# EAGLE design Motor Controller V.5.2 (EAGLE 9.6.2)
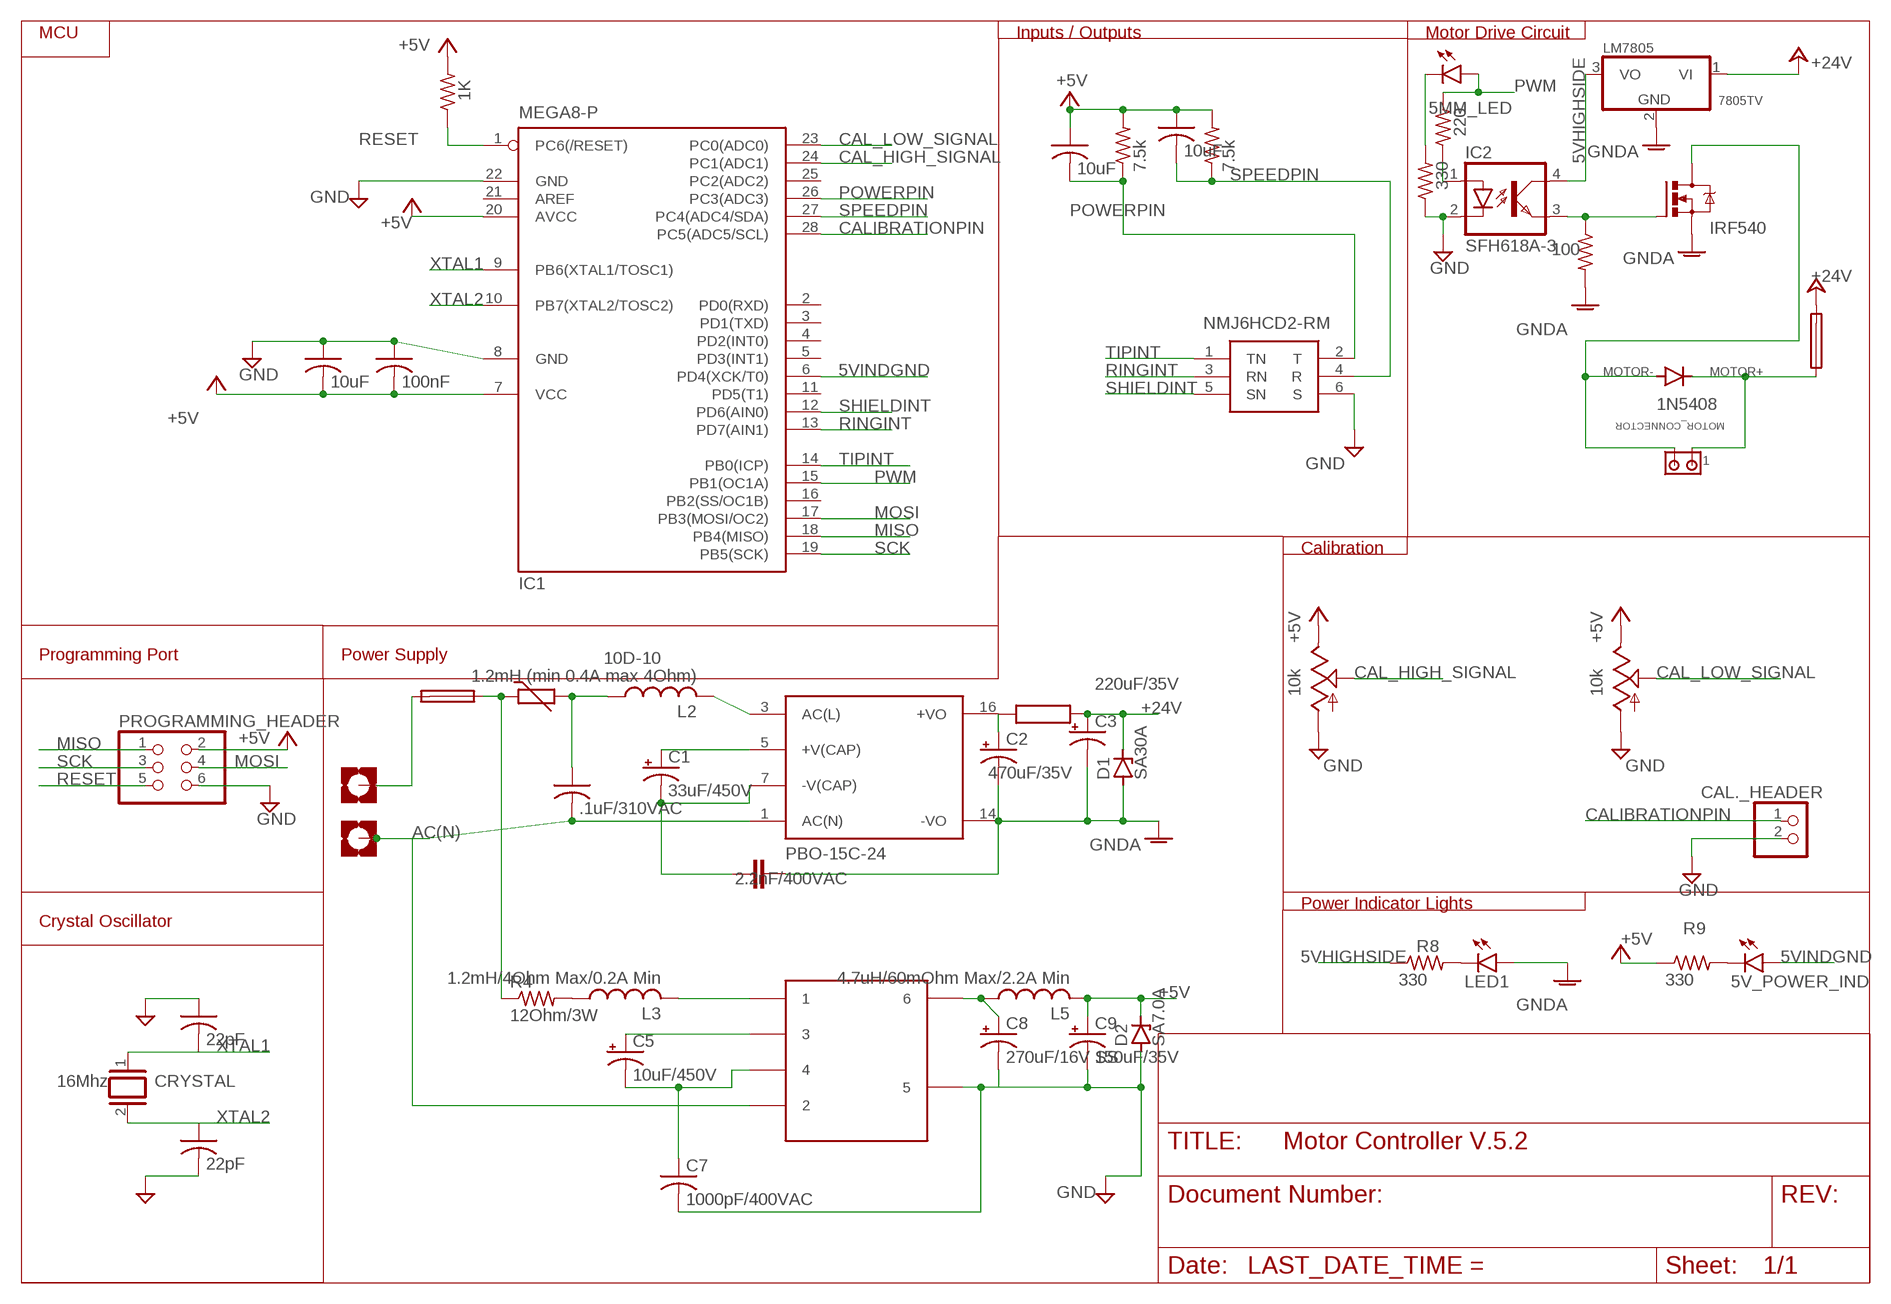
[diagram p0: schematic, sheet 1]

## Parts
5V_POWER_IND  LED3MM  [LED3MM]
AC(N)  PAD3.0  [3,0-PAD-SQUARE]
C1  33uF/450V  CPOL-USE5-13  [E5-13]
C2  470uF/35V  CPOL-USE5-10.5  [E5-10,5]
C3  220uF/35V  CPOL-USE5-10.5  [E5-10,5]
C4  .1uF/310VAC  CMPP_AC275V104K10S6  [C102-064X133]
C5  10uF/450V  CPOL-USE5-10.5  [E5-10,5]
C6  22pF  C-US025-024X044  [C025-024X044]
C7  1000pF/400VAC  C-US075-052X106  [C075-052X106]
C8  270uF/16V SS  CPOL-USE2.5-6  [E2,5-6]
C9  150uF/35V  CPOL-USE3.5-8  [E3,5-8]
C10  10uF  C-US025-024X044  [C025-024X044]
C12  10uF  C-US025-024X044  [C025-024X044]
C13  10uF  C-US025-024X044  [C025-024X044]
C14  100nF  C-US025-024X044  [C025-024X044]
C15  22pF  C-US025-024X044  [C025-024X044]
CAL._HEADER  PINHD-1X2  [1X02]
CRYSTAL  16Mhz  XTAL/S  [QS]
CY1  2.2nF/400VAC  CYYC10B4  [YC10B4]
D1  SA30A  TVSDIO  [TVS-10]
D2  SA7.0A  TVSDIO  [TVS-10]
D3  1N5408  1N5400  [DO201-15]
F1  FUSESH22,5  [SH22,5]
F2  1A/300V  FUSESH22,5  [SH22,5]
FAST  10k  TRIM_US-CT6  [CT6]
H1  PAD3.0  [3,0-PAD-SQUARE]
IC1  MEGA8-P  [DIL28-3]
IC2  SFH618A-3  [DIP4]
J1  NMJ6HCD2-RM  [NMJ6HCD2RM]
L2  1.2mH (min 0.4A max 4Ohm)  RCP_1317_INDUCTOR  [RCP1317_INDUCTOR]
L3  1.2mH/4Ohm Max/0.2A Min  RCP_1317_INDUCTOR  [RCP1317_INDUCTOR]
L5  4.7uH/60mOhm Max/2.2A Min  RLB0914_INDUCTOR  [RLB0914_INDUCTOR]
LED1  LED3MM  [LED3MM]
LM7805  7805TV  [TO220V]
MOTOR_CONNECTOR  MATE-N-LOK_193839-1  [MATE-N-LOK_2PIN_CONNECTOR]
PROGRAMMING_HEADER  PINHD-2X3  [2X03]
PS1  PBO-15C-24  [CONV_PBO-15C-24]
PWM_IND  5MM_LED  [5MM_LED]
Q1  IRF540  [TO220BV]
R1  10D-10  THERMISTOR-7,5  [R-7,5]
R2  1K  R-US_0204/7  [0204/7]
R3  7.5k  R-US_0204/7  [0204/7]
R4  12Ohm/3W  BIGRESISTOR  [VTA52]
R5  220  R-US_0204/7  [0204/7]
R6  100  R-US_0204/7  [0204/7]
R7  7.5k  R-US_0204/7  [0204/7]
R8  330  R-US_0204/7  [0204/7]
R9  330  R-US_0204/7  [0204/7]
R10  330  R-US_0204/7  [0204/7]
SLOW  10k  TRIM_US-CT6  [CT6]
U$1  L503-13B05R  [LS03-13BO5R3]
U$2  HCTI-22-16.4  [HCTI-22-16.4]

## Nets
5VHIGHSIDE: IC2.4(COL) LM7805.3(VO) R8.1
5VINDGND: 5V_POWER_IND.A IC1.6(PD4(XCK/T0))
+5V: C9.+ C10.1 C12.1 C13.2 C14.2 D2.C FAST.E IC1.7(VCC) IC1.20(AVCC) L5.P$2 PROGRAMMING_HEADER.2 R2.2 R3.2 R7.2 R9.1 SLOW.E
+24V: C3.+ D1.C F1.2 LM7805.1(VI) U$2.P$2
AC(L): L2.P$2 PS1.3(AC(L))
AC(N): AC(N).B3,0(MOUNT) C4.2 PS1.1(AC(N)) U$1.3 U$1.4
CAL_HIGH_SIGNAL: FAST.S IC1.24(PC1(ADC1))
CAL_LOW_SIGNAL: IC1.23(PC0(ADC0)) SLOW.S
CALIBRATIONPIN: CAL._HEADER.1 IC1.28(PC5(ADC5/SCL))
GND: C6.2 C7.2 C8.- C9.- C13.1 C14.1 C15.1 CAL._HEADER.2 D2.A FAST.A IC1.8(GND) IC1.22(GND) IC2.2(C) J1.6(S) PROGRAMMING_HEADER.6 R10.1 SLOW.A U$1.9 U$1.10
GNDA: C2.- C3.- CY1.1 D1.A LED1.A LM7805.2(GND) PS1.14(-VO) Q1.S R6.2
MISO: IC1.18(PB4(MISO)) PROGRAMMING_HEADER.1
MOSI: IC1.17(PB3(MOSI/OC2)) PROGRAMMING_HEADER.4
MOTOR+: D3.C F1.1 MOTOR_CONNECTOR.P$1
MOTOR-: D3.A MOTOR_CONNECTOR.P$2 Q1.D
N$1: IC2.1(A) R5.1
N$2: IC2.3(EMIT) Q1.G R6.1
N$3: LED1.K(C) R8.2
N$4: C2.+ PS1.16(+VO) U$2.P$1
N$5: C1.+ PS1.5(+V(CAP))
N$6: C1.- CY1.2 PS1.7(-V(CAP))
N$8: F2.2 H1.B3,0(MOUNT)
N$9: F2.1 R1.1 R4.1
N$10: C4.1 L2.P$1 R1.2
N$12: 5V_POWER_IND.K(C) R9.2
N$13: L3.P$1 R4.2
N$14: L3.P$2 U$1.1 U$1.2
N$15: C5.+ U$1.5 U$1.6
N$16: C5.- C7.1 U$1.7 U$1.8
N$17: C8.+ L5.P$1 U$1.11 U$1.12
N$19: PWM_IND.C R10.2
POWERPIN: C10.2 IC1.26(PC3(ADC3)) J1.2(T) R3.1
PWM: IC1.15(PB1(OC1A)) PWM_IND.A R5.2
RESET: IC1.1(PC6(/RESET)) PROGRAMMING_HEADER.5 R2.1
RINGINT: IC1.13(PD7(AIN1)) J1.3(RN)
SCK: IC1.19(PB5(SCK)) PROGRAMMING_HEADER.3
SHIELDINT: IC1.12(PD6(AIN0)) J1.5(SN)
SPEEDPIN: C12.2 IC1.27(PC4(ADC4/SDA)) J1.4(R) R7.1
TIPINT: IC1.14(PB0(ICP)) J1.1(TN)
XTAL1: C15.2 CRYSTAL.1 IC1.9(PB6(XTAL1/TOSC1))
XTAL2: C6.1 CRYSTAL.2 IC1.10(PB7(XTAL2/TOSC2))
Unconnected: IC1.2(PD0(RXD)) IC1.3(PD1(TXD)) IC1.4(PD2(INT0)) IC1.5(PD3(INT1)) IC1.11(PD5(T1)) IC1.16(PB2(SS/OC1B)) IC1.21(AREF) IC1.25(PC2(ADC2))

## Notes on the sheet
- MCU | Inputs / Outputs | Motor Drive Circuit
- Calibration
- Programming Port | Power Supply
- Power Indicator Lights
- Crystal Oscillator

## Library data of the parts
5V_POWER_IND LED1 = led:LED: LED OSRAM: - CHIPLED LG R971, LG N971, LY N971, LG Q971, LY Q971, LO R971, LY R971 LH N974, LH R974 LS Q976, LO Q976, LY Q976 LO Q996 - Hyper CHIPLED LW Q18S LB Q993, LB Q99A, LB R99A - SideLED LS A670, LO A670, LY A670, LG A670, LP A670 LB A673, LV A673, LT A673, LW A673 LH A674 LY A675 LS A676, LA A676, LO A676, LY A676, LW A676 LS A679, LY A679, LG A679 - Hyper Micro SIDELED® LS Y876, LA Y876, LO Y876, LY Y876 LT Y87S - SmartLED LW L88C, LW L88S LB L89C, LB L89S, LG L890 LS L89K, LO L89K, LY L89K LS L896, LA L896, LO L896, LY L896 - TOPLED LS T670, LO T670, LY T670, LG T670, LP T670 LSG T670, LSP T670, LSY T670, LOP T670, LYG T670 LG T671, LOG T671, LSG T671 LB T673, LV T673, LT T673, LW T673 LH T674 LS T676, LA T676, LO T676, LY T676, LB T676, LH T676, LSB T676, LW T676 LB T67C, LV T67C, LT T67C, LS T67K, LO T67K, LY T67K, LW E67C LS E67B, LA E67B, LO E67B, LY E67B, LB E67C, LV E67C, LT E67C LW T67C LS T679, LY T679, LG T679 LS T770, LO T770, LY T770, LG T770, LP T770 LB T773, LV T773, LT T773, LW T773 LH T774 LS E675, LA E675, LY E675, LS T675 LS T776, LA T776, LO T776, LY T776, LB T776 LHGB T686 LT T68C, LB T68C - Hyper Mini TOPLED® LB M676 - Mini TOPLED Santana® LG M470 LS M47K, LO M47K, LY M47K Source: http://www.osram.convergy.de LUXEON: - LUMILED® LXK2-PW12-R00, LXK2-PW12-S00, LXK2-PW14-U00, LXK2-PW14-V00 LXK2-PM12-R00, LXK2-PM12-S00, LXK2-PM14-U00 LXK2-PE12-Q00, LXK2-PE12-R00, LXK2-PE12-S00, LXK2-PE14-T00, LXK2-PE14-U00 LXK2-PB12-K00, LXK2-PB12-L00, LXK2-PB12-M00, LXK2-PB14-N00, LXK2-PB14-P00, LXK2-PB14-Q00 LXK2-PR12-L00, LXK2-PR12-M00, LXK2-PR14-Q00, LXK2-PR14-R00 LXK2-PD12-Q00, LXK2-PD12-R00, LXK2-PD12-S00 LXK2-PH12-R00, LXK2-PH12-S00 LXK2-PL12-P00, LXK2-PL12-Q00, LXK2-PL12-R00 Source: www.luxeon.com KINGBRIGHT: KA-3528ASYC Source: www.kingbright.com
AC(N) H1 = Benson Motor Controller:PAD3.0; OC_NEWARK: unknown
C1 C5 C8 C9 = rcl:CPOL-US: POLARIZED CAPACITOR, American symbol; OC_NEWARK: unknown; SPICEPREFIX: C
C2 = rcl:CPOL-US: POLARIZED CAPACITOR, American symbol; MF: PANASONIC; MPN: ECA1VHG471B; OC_NEWARK: 65AH6137; SPICEPREFIX: C
C3 = rcl:CPOL-US: POLARIZED CAPACITOR, American symbol; MF: KEMET; MPN: A768KS227M1VLAE024; OC_NEWARK: 92AH3968; SPICEPREFIX: C
C4 = Benson Motor Controller:CMPP_AC275V104K10S6: capacitor .1uf 275VAC; OC_NEWARK: unknown
C6 C7 C10 C12-C15 = rcl:C-US: CAPACITOR, American symbol; OC_NEWARK: unknown; SPICEPREFIX: C
CAL._HEADER = pinhead:PINHD-1X2: PIN HEADER; OC_NEWARK: unknown
CRYSTAL = special:XTAL/S: CRYSTAL; OC_NEWARK: unknown
CY1 = rcl:CY: Y CAPACITOR for power line; OC_NEWARK: unknown; SPICEPREFIX: C
D1 D2 = Benson Motor Controller:TVSDIO: TVS diode 9.0mm hole spacing; OC_NEWARK: unknown
D3 = diode:1N5400: DIODE standard rectifier, 3 A, 50 V (Motorola); MF: VISHAY; MPN: 1N5408-E3/54; OC_NEWARK: 05R6001
F1 F2 = fuse:FUSE: Fuse; OC_FARNELL: unknown; OC_NEWARK: unknown
FAST SLOW = pot:TRIM_US-: POTENTIOMETER; OC_NEWARK: unknown
IC1 = atmel:MEGA8-P: MICROCONTROLLER 8 Kbytes FLASH, 1 kbytes SRAM, 512 bytes EEPROM, USART, 4-channel 10 bit ADC, 2-channel 8 bit ADC Pin compatible with Atmega48, ATMega88, ATMega168 Source: avr.lbr; OC_FARNELL: unknown; OC_NEWARK: unknown
IC2 = optocoupler:SFH618?*: Optocoupler, Phototransistor Output, Low Input Current Source: Data sheet <http://www.vishay.com/docs/83673/sfh618.pdf>; MF: VISHAY/TELEFUNKEN; MPN: SFH618A-3; OC_FARNELL: 1020374; OC_NEWARK: 58K2209
J1 = SamacSys_Parts:NMJ6HCD2-RM: NMJ6HCD2-RM Phone Connectors 1/4" STERO JCK SWTCH FULL TRD NSE PC HORZ Source: Datasheet <https://www.mouser.com/datasheet/2/289/st-nmj6hcd2-1842677.pdf>; DESCRIPTION: NMJ6HCD2-RM Phone Connectors 1/4" STERO JCK SWTCH FULL TRD NSE PC HORZ; HEIGHT: 15.67mm; MANUFACTURER_NAME: Neutrik; MANUFACTURER_PART_NUMBER: NMJ6HCD2-RM; MOUSER_PART_NUMBER: 568-NMJ6HCD2-RM; MOUSER_PRICE-STOCK: https://www.mouser.co.uk/ProductDetail/Neutrik/NMJ6HCD2-RM?qs=%252B86TLfaev28zLpqKj2fOGg%3D%3D; OC_NEWARK: unknown
L2 L3 = Benson Motor Controller:RCP_1317_INDUCTOR; OC_NEWARK: unknown
L5 = Benson Motor Controller:RLB0914_INDUCTOR; OC_NEWARK: unknown
LM7805 = linear:78*: Positive VOLTAGE REGULATOR Source: http://cache.national.com/ds/LM/LM78L05.pdf http://www.fairchildsemi.com/ds/LM/LM7805.pdf; OC_NEWARK: unknown
MOTOR_CONNECTOR = Benson Motor Controller:MATE-N-LOK_193839-1: right angle connector mate n lok 193839-1 mates with pn 770017-1; OC_NEWARK: unknown
PROGRAMMING_HEADER = pinhead:PINHD-2X3: PIN HEADER; OC_NEWARK: unknown
PS1 = Benson Motor Controller:PBO-15C-24: Check prices <https://pricing.snapeda.com/parts/PBO-15C-24/CUI%20Inc./view-part?ref=eda>; AVAILABILITY: Warning; CUI_PURCHASE_URL: https://www.cui.com/product/internal-ac-dc-power-supplies/board-mount/pbo-15c-series?utm_source=snapeda.com&utm_medium=referral&utm_campaign=snapedaBOM; DESCRIPTION: 15 W, 85 ~ 305 Vac Input, Single Output, Open Frame, Board Mount, Ac-Dc Power Supply; MF: CUI Inc.; MP: PBO-15C-24; OC_NEWARK: unknown; PACKAGE: None; PRICE: None; PURCHASE-URL: https://pricing.snapeda.com/search/part/PBO-15C-24/?ref=eda
PWM_IND = Benson Motor Controller:5MM_LED
Q1 = transistor-power:IRF540: HEXFET Power MOSFET; OC_NEWARK: unknown
R1 = Benson Motor Controller:THERMISTOR: THERMISTOR Inrush current limiting resitor 10ohm 20% 2A 11mm datasheet <https://www.cantherm.com/wp-content/uploads/2018/08/MF72_AUG_2018.pdf>; OC_NEWARK: unknown
R2 R3 R5-R7 R10 = rcl:R-US_: RESISTOR, American symbol; OC_NEWARK: unknown; SPICEPREFIX: R
R4 = Benson Motor Controller:BIGRESISTOR; OC_NEWARK: unknown
R8 R9 = rcl:R-US_: RESISTOR, American symbol; SPICEPREFIX: R
U$1 = Benson Motor Controller:L503-13B05R: Mornsun 5V 3W Isolated Power supply LS03-13B05R Datasheet <https://www.mornsun-power.com/html/pdf/LS03-13BxxR3.html>; OC_NEWARK: unknown
U$2 = Benson Motor Controller:HCTI-22-16.4

## Board
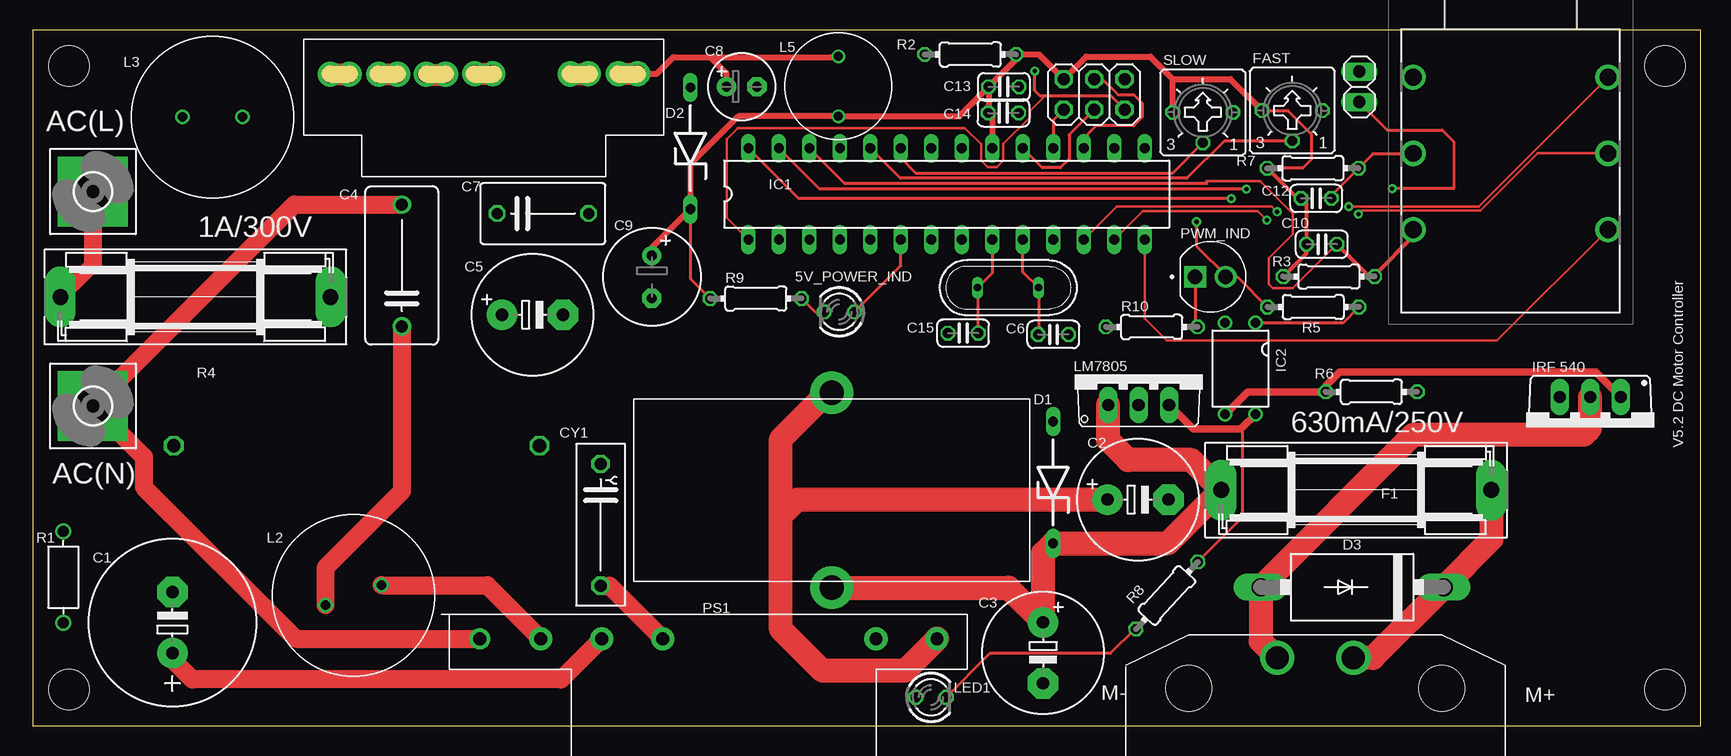
[diagram p1: board, top side]
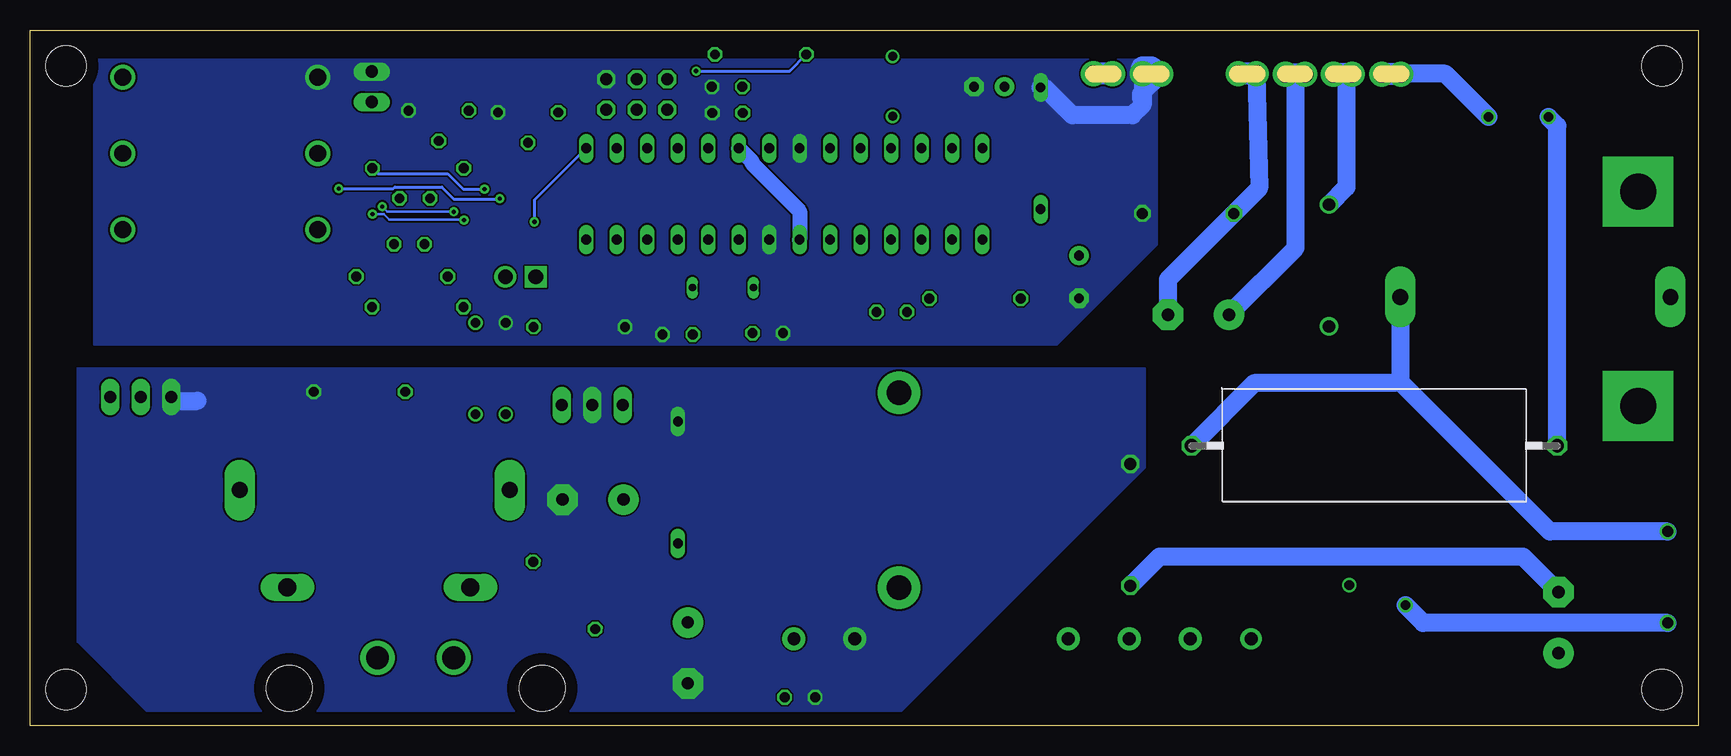
[diagram p2: board, bottom side, seen from below]

Size 139 x 58 mm. Coordinates in mm from the lower left corner, seen from the top.
Outline: 0,0 139,0 139,58 0,58 0,0
Copper layers (1*16): Top 0.035mm / dielectric 1.5mm / Bottom 0.035mm
Design rules "default *": minimum track width 6mil, minimum drill 0.35mm, track to track 6mil, track to pad 6mil, pad to pad 6mil, via to via 6mil, smd to smd 6mil, copper to edge 40mil, drill to drill 6mil, minimum pad ring 1mil, minimum via ring 8mil, stop-mask expansion 4mil, vias tented up to drill 0mil, thermal gap 0mil
Holes 3.33 mm at 136,55 136,3 3,55 3,3

### Footprints (pad centres in the part's own frame; a part is rotated, then mirrored left to right if it is on the bottom)
LED3MM = drill 0.813 octagon: A -1.27,0; K 1.27,0
3,0-PAD-SQUARE = drill 3 pad 5.842 square: B3,0 0,0
E5-13 = drill 1.016 pad 2.54: + -2.54,0 | drill 1.016 pad 2.54 octagon: - 2.54,0
E5-10,5 = drill 1.016 pad 2.54: + -2.54,0 | drill 1.016 pad 2.54 octagon: - 2.54,0
C102-064X133 = drill 1.016: 1 -5.08,0; 2 5.08,0
C025-024X044 = drill 0.813 octagon: 1 -1.27,0; 2 1.27,0
C075-052X106 = drill 0.914 octagon: 1 -3.81,0; 2 3.81,0
E2,5-6 = drill 0.813 pad 1.6: + -1.27,0 | drill 0.813 pad 1.6 octagon: - 1.27,0
E3,5-8 = drill 0.813 pad 1.6: + -1.778,0 | drill 0.813 pad 1.6 octagon: - 1.778,0
1X02 = drill 1.016 long: 1 -1.27,0; 2 1.27,0
QS = drill 0.61 long: 1 -2.54,0; 2 2.54,0
YC10B4 = drill 1.016 octagon: 1 -5.08,0; 2 5.08,0
TVS-10 = drill 0.813 long: A 5.08,0; C -5.08,0
DO201-15 = drill 1.499 long: A 7.62,0; C -7.62,0
SH22,5 = drill 1.321 pad 2.54 long: 1 -11.252,0; 2 11.252,0
CT6 = drill 0.813 octagon: A 2.515,0; E -2.515,0; S 0,-2.54
DIL28-3 = drill 0.813 long: 1 -16.51,-3.81; 2 -13.97,-3.81; 3 -11.43,-3.81; 4 -8.89,-3.81; 5 -6.35,-3.81; 6 -3.81,-3.81; 7 -1.27,-3.81; 8 1.27,-3.81; 9 3.81,-3.81; 10 6.35,-3.81; 11 8.89,-3.81; 12 11.43,-3.81; 13 13.97,-3.81; 14 16.51,-3.81; 15 16.51,3.81; 16 13.97,3.81; 17 11.43,3.81; 18 8.89,3.81; 19 6.35,3.81; 20 3.81,3.81; 21 1.27,3.81; 22 -1.27,3.81; 23 -3.81,3.81; 24 -6.35,3.81; 25 -8.89,3.81; 26 -11.43,3.81; 27 -13.97,3.81; 28 -16.51,3.81
DIP4 = drill 0.8: 1 -1.27,-3.81; 2 1.27,-3.81; 3 1.27,3.81; 4 -1.27,3.81
NMJ6HCD2RM = drill 1.4 pad 2.1: 1 0,0; 2 0,16.23; 3 6.35,0; 4 6.35,16.23; 5 12.7,0; 6 12.7,16.23
RCP1317_INDUCTOR = drill 0.8: P$1 0,2.489; P$2 0,-2.489
RLB0914_INDUCTOR = drill 0.75: P$1 2.502,0; P$2 -2.502,0
TO220V = drill 1.016 long: 1 -2.54,-2.54; 2 0,-2.54; 3 2.54,-2.54
MATE-N-LOK_2PIN_CONNECTOR = drill 1.905: P$1 -3.175,-2.54; P$2 3.175,-2.54 | hole 3.81: -10.541,0; 10.541,0
2X03 = drill 1.016 octagon: 1 -2.54,-1.27; 2 -2.54,1.27; 3 0,-1.27; 4 0,1.27; 5 2.54,-1.27; 6 2.54,1.27
CONV_PBO-15C-24 = drill 1.067 pad 1.778: 1 -19.05,0 | drill 1.067 pad 1.93: 3 -13.97,0; 14 13.97,0 | drill 1.067 pad 1.905: 5 -8.89,0; 7 -3.81,0; 16 19.05,0
5MM_LED = drill 1.21: A 1.27,0 | drill 1.21 square: C -1.27,0
TO220BV = drill 1.016 long: D 0,-2.54; G -2.54,-2.54; S 2.54,-2.54
R-7,5 = drill 0.9: 1 -3.81,0; 2 3.81,0
0204/7 = drill 0.813 octagon: 1 -3.81,0; 2 3.81,0
VTA52 = drill 1.1 octagon: 1 -15.24,0; 2 15.24,0
LS03-13BO5R3 = drill 1.397 pad 1.829: 1 -12.802,5.08; 2 -11.201,5.08; 3 -8.755,5.08; 4 -7.188,5.08; 5 -4.786,5.08; 6 -3.19,5.08; 7 -0.759,5.129; 8 0.747,5.129; 9 7.205,5.092; 10 8.724,5.104; 11 11.23,5.104; 12 12.81,5.117
HCTI-22-16.4 = drill 2.032 pad 3.556: P$1 0,8.128; P$2 0,-8.128

### Placement (x,y rotation side)
5V_POWER_IND  67.19,34.48 180 top
AC(N)  5,26.65 0 top
C1  11.63,8.59 90 top
C2  92.09,18.84 0 top
C3  84.18,6.06 270 top
C4  30.74,38.36 90 top
C5  41.63,34.25 0 top
C6  85.03,32.61 0 top
C7  42.49,42.69 0 top
C8  59.06,53.27 0 top
C9  51.58,37.41 270 top
C10  107.4,40.14 0 top
C12  106.93,43.96 0 top
C13  80.91,53.26 180 top
C14  80.87,51.08 180 top
C15  77.51,32.72 0 top
CAL._HEADER  110.53,53.26 90 top
CRYSTAL  81.26,36.51 0 top
CY1  47.31,16.74 270 top
D1  85.01,20.27 90 top
D2  54.79,48.14 90 top
D3  109.93,11.54 180 top
F1  110.28,19.64 180 top
F2  13.55,35.74 180 top
FAST  104.94,51.28 0 top
H1  5,44.53 0 top
IC1  76.14,44.33 0 top
IC2  100.62,29.76 180 top
J1  131.26,41.36 90 top
L2  26.72,10.86 109.5 top
L3  14.96,50.74 90 top
L5  67.12,53.3 90 top
LED1  74.84,2.36 0 top
LM7805  92.14,29.27 0 top
MOTOR_CONNECTOR  106.86,3.1 180 top
PROGRAMMING_HEADER  88.43,52.63 0 top
PS1  56.29,7.23 0 top
PWM_IND  98.12,37.42 0 top
Q1  129.77,24.85 180 top
R1  2.53,12.37 270 top
R2  78.12,55.96 0 top
R3  108,37.44 180 top
R4  26.97,23.33 0 bottom
R5  106.69,34.9 180 top
R6  111.54,27.82 0 top
R7  106.66,46.47 180 top
R8  94.49,10.84 227.3 top
R9  60.25,35.61 0 top
R10  93.23,33.23 0 top
SLOW  97.49,51.13 0 top
U$1  37.56,49.24 0 top
U$2  66.57,19.63 0 top

### Tracks (layer width: path | path; a pad name or v marks a point on that pad's centre or on a via)
5VHIGHSIDE
  Top 0.254: 100.67,24.73 100.78,24.84 100.78,17.35 R8.1
  Top 0.635: LM7805.3 96.68,24.73 100.67,24.73 | 100.78,24.84 IC2.4
5VINDGND
  Top 0.254: 5V_POWER_IND.A 72.33,38.35 IC1.6
+5V
  Top 0.254: D2.C 54.79,37.25 R9.1 | FAST.E 104.58,51.28 106.54,49.32 106.54,47.2 105.81,46.47 R7.2
  Top 0.318: R3.2 106.13,39.37 C10.1 106.13,43.5 C12.1 105.36,43.96 R7.2
  Top 0.508: C9.+ 51.58,39.84 D2.C 54.77,43.08 54.77,46.79 58.78,50.8 L5.P$2 77.18,50.8 C13.2 | C13.2 79.64,51.12 C14.2 79.94,50.74 IC1.20 | C13.2 81.93,55.55 R2.2 83.83,55.96 PROGRAMMING_HEADER.2 87.77,55.77 93.12,55.77 94.98,53.91 | SLOW.E 94.98,53.91 | 94.98,53.91 99.79,53.91 FAST.E
  Bottom 1.27: IC1.20 78.85,47.04 78.85,46.88 74.86,42.89 IC1.7
+24V
  Top 2: U$2.P$2 81.28,11.5 C3.+ 84.18,14.37 D1.C 94.58,15.19 F1.2 96.53,22.14 91.26,22.14 89.6,23.79 LM7805.1
AC(L)
  Top 1.5: L2.P$2 37.86,11.69 PS1.3
AC(N)  (1 unrouted)
  Top 1.5: C4.2 21.8,43.44 AC(N).B3,0 9.25,22.4 9.25,19.88 21.89,7.23 PS1.1
  Bottom 1.5: U$1.3 29.3,53.59 29.3,44.89 C4.2
CAL_HIGH_SIGNAL
  Top 0.254: FAST.S 99.28,48.74 96.17,45.63 72.29,45.63 IC1.24
CAL_LOW_SIGNAL
  Top 0.254: SLOW.S 94.94,46.04 73.63,46.04 72.33,47.34 IC1.23
CALIBRATIONPIN  (via drill 0.35)
  Top 0.254: CAL._HEADER.1 112.87,49.66 117.43,49.66 118.4,48.7 118.4,44.76 v113.26,44.76 | v99.86,43.95 63.81,43.95 IC1.28
  Bottom 0.254: v113.26,44.76 108.73,44.76 108.59,44.9 104.68,44.9 103.67,43.89 99.91,43.89 v99.86,43.95
GND
  Bottom 1.499: 46.29,52.51 46.29,52.5 46.43,52.35 46.43,52.67 U$1.9 45.49,55.05 46.34,55.05 46.51,54.88 46.29,54.66 U$1.10 46.29,51.73 47.15,50.88 52.14,50.88 54.48,53.22 D2.A
  pour Bottom: 45.12,55.55 45.12,40.06 53.45,31.73 133.66,31.73 133.66,55.55
GNDA
  Bottom 1.499: Q1.S 126.91,27.07 125.02,27.07
  pour Bottom: 135.03,29.81 46.11,29.81 46.11,21.47 66.38,1.2 129.25,1.2 135.03,6.98
MISO
  Top 0.254: PROGRAMMING_HEADER.1 85.03,50.49 IC1.18
MOSI
  Top 0.254: PROGRAMMING_HEADER.4 89.12,53.9 90.42,52.6 91.75,52.6 92.44,51.9 92.44,50.71 91.75,50.02 88.59,50.02 87.56,48.99 IC1.17
MOTOR+
  Top 2: F1.1 121.53,15.52 D3.C 111.65,5.64 MOTOR_CONNECTOR.P$1
MOTOR-
  Top 2: Q1.D 129.77,24.79 129.25,24.27 115.04,24.27 D3.A 102.31,7.02 MOTOR_CONNECTOR.P$2
N$1
  Top 0.254: R5.1 109.17,33.57 IC2.1
N$2
  Top 0.254: 107.73,28.3 R6.1
  Top 0.635: Q1.G 130.24,29.47 108.91,29.47 107.73,28.3 | R6.1 101.22,27.82 IC2.3
N$3
  Top 0.254: LED1.K 79.75,6 89.8,6 91.83,8.04 R8.2
N$4
  Top 2: PS1.16 72.68,4.57 65.79,4.57 62.33,8.04 62.33,17.48 | 62.33,17.48 62.33,23.88 66.2,27.75 U$2.P$1 | 62.33,17.48 63.69,18.84 C2.+
N$5
  Top 1.5: PS1.5 44.02,3.85 13.28,3.85 11.07,6.07 11.61,6.07
  Top 2: 11.61,6.07 C1.+
N$6
  Top 1.5: CY1.2 48.05,11.66 PS1.7
  Bottom 1.5: C1.- 14.58,14.08 44.89,14.08 CY1.2
N$8
  Top 0.61: 5,38.48 5,38.45
  Top 1.27: 5,38.45 F2.2
  Top 1.5: H1.B3,0 5,38.48
N$9
  Bottom 1.499: F2.1 24.8,28.63 24.72,28.55 36.98,28.55 R4.1
  Bottom 1.5: R1.1 12.35,16.18 24.72,28.55
N$10
  Top 1.5: C4.1 30.75,19.52 24.37,13.15 L2.P$1
  Bottom 1.5: R1.2 22.9,8.56 L2.P$1
N$12
  Top 0.254: R9.2 65.18,34.48 5V_POWER_IND.K
N$13
  Bottom 1.5: R4.2 11.72,49.99 L3.P$1
N$14  (2 unrouted)
  Bottom 1.5: L3.P$2 21.06,54.35 25.18,54.35
N$15  (2 unrouted)
  Bottom 1.5: C5.+ 33.53,39.82 33.53,54.2
N$16  (1 unrouted)
  Bottom 1.5: U$1.7 36.57,44.81 C7.1 44.17,37.2 C5.-
N$17  (1 unrouted)
  Top 0.508: U$1.12 51.97,54.35 53.38,55.75 56.45,55.75 | C8.+ 57.79,54.41 56.45,55.75 | 56.45,55.75 67.06,55.75 L5.P$1
N$19
  Top 0.254: PWM_IND.C 96.85,33.42 R10.2
POWERPIN
  Top 0.203: C10.2 105,36.47 103.33,36.47 102.98,36.82 102.98,38.97 105,40.98 105,42.68 102.29,45.39 97.79,45.39
  Top 0.254: 97.79,45.39 97.79,45.17 67.67,45.17 IC1.26
  Top 0.305: 115.03,40.8 J1.2
  Top 0.318: 115.03,40.8 111.81,37.58 R3.1 111.36,37.44 C10.2
PWM  (via drill 0.35)
  Top 0.254: PWM_IND.A 99.52,37.42 | 99.52,37.42 100.36,37.42 R5.2 | v96.96,42 96.96,39.98 99.52,37.42
  Bottom 0.254: IC1.15 96.96,43.82 v96.96,42
RESET  (via drill 0.35)
  Top 0.203: IC1.1 57.8,42.34 57.8,44.34 57.8,48.91 58.72,49.83 77.67,49.83 79.03,48.46 79.03,47.1 79.57,46.56 80.32,46.56 80.86,47.1 80.86,48.51 83.06,50.7 83.06,51.22 84.32,52.49
  Top 0.254: PROGRAMMING_HEADER.5 89.84,52.49 84.32,52.49 83.94,52.49 83.49,52.93 v83.49,54.58
  Bottom 0.254: v83.49,54.58 75.69,54.58 R2.1
RINGINT  (via drill 0.35)
  Top 0.203: J1.3 125.41,47.71 120.62,42.92 110.73,42.92 v110.45,42.65 | v102.83,42.16 102.88,42.12 102.88,42.08 102.07,42.88 92.47,42.88 IC1.13
  Bottom 0.203: v110.45,42.65 109.52,42.65 109.08,42.21 102.89,42.21 v102.83,42.16
SCK
  Top 0.254: PROGRAMMING_HEADER.3 86.35,49.27 86.35,47.23 85.62,46.51 84.12,46.51 IC1.19
SHIELDINT  (via drill 0.35)
  Top 0.203: J1.5 120.47,43.28 v109.65,43.28 | v103.68,42.84 103.24,43.28 90.33,43.28 IC1.12
  Bottom 0.203: v109.65,43.28 109.21,42.84 v103.68,42.84
SPEEDPIN  (via drill 0.35)
  Top 0.254: v101.13,44.73 101.13,44.75 65.55,44.75 IC1.27 | C12.2 108.2,44.2 R7.1 111.69,47.69 115.05,47.69
  Top 0.305: 115.05,47.69 J1.4
  Bottom 0.254: v101.13,44.73 102.91,44.73 104.19,46.01 110.01,46.01 R7.1
TIPINT
  Top 0.203: J1.1 121.98,32.09 94.49,32.09 92.64,33.94 IC1.14
XTAL1
  Top 0.254: C15.2 78.72,32.78 CRYSTAL.1 79.94,37.74 IC1.9
XTAL2
  Top 0.254: C6.1 83.8,32.73 CRYSTAL.2 82.48,37.83 IC1.10

### Text on the board
tPlace: AC(L) | 1A/300V | LM7805 | IRF 540 | 630mA/250V | AC(N)
tNames: V5.2 DC Motor Controller | M- | M+